# EAGLE design marqee_attiny85 (EAGLE 8.5.2)
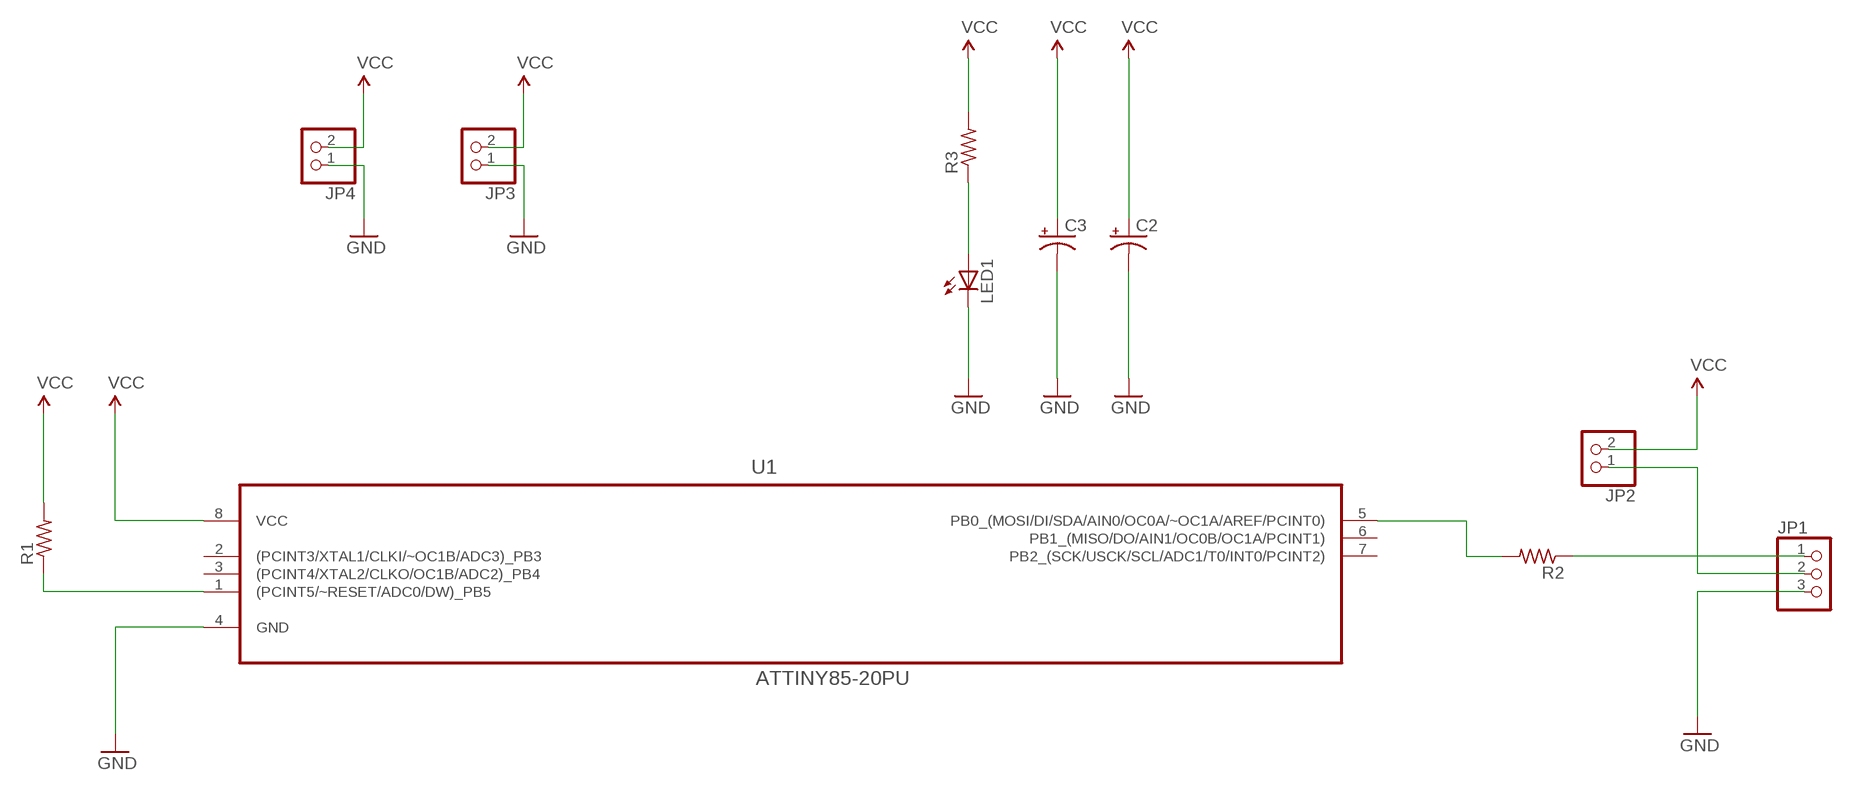
[diagram p0: schematic, sheet 1]

## Parts
C2  CPOL-USE5-8.5  [E5-8,5]
C3  CPOL-USE5-8.5  [E5-8,5]
JP1  PINHD-1X3  [1X03]
JP2  PINHD-1X2  [1X02]
JP3  PINHD-1X2  [1X02]
JP4  PINHD-1X2  [1X02]
LED1  LED5MM  [LED5MM]
R1  R-US_0207/10  [0207/10]
R2  R-US_0207/10  [0207/10]
R3  R-US_0207/10  [0207/10]
U1  ATTINY85-20PU  [DIP254P762X533-8]

## Nets
GND: C2.- C3.- JP1.3 JP3.1 JP4.1 LED1.K(C) U1.4(GND)
N$1: R1.1 U1.1((PCINT5/~RESET/ADC0/DW)_PB5)
N$2: JP1.1 R2.1
N$3: LED1.A R3.1
N$4: R2.2 U1.5(PB0_(MOSI/DI/SDA/AIN0/OC0A/~OC1A/AREF/PCINT0))
N$6: JP1.2 JP2.1
VCC: C2.+ C3.+ JP2.2 JP3.2 JP4.2 R1.2 R3.2 U1.8(VCC)
Unconnected: U1.2((PCINT3/XTAL1/CLKI/~OC1B/ADC3)_PB3) U1.3((PCINT4/XTAL2/CLKO/OC1B/ADC2)_PB4) U1.6(PB1_(MISO/DO/AIN1/OC0B/OC1A/PCINT1)) U1.7(PB2_(SCK/USCK/SCL/ADC1/T0/INT0/PCINT2))

## Library data of the parts
C2 C3 = rcl:CPOL-US: POLARIZED CAPACITOR, American symbol; SPICEPREFIX: C
JP1 = pinhead:PINHD-1X3: PIN HEADER
JP2-JP4 = pinhead:PINHD-1X2: PIN HEADER
LED1 = led:LED: LED OSRAM: - CHIPLED LG R971, LG N971, LY N971, LG Q971, LY Q971, LO R971, LY R971 LH N974, LH R974 LS Q976, LO Q976, LY Q976 LO Q996 - Hyper CHIPLED LW Q18S LB Q993, LB Q99A, LB R99A - SideLED LS A670, LO A670, LY A670, LG A670, LP A670 LB A673, LV A673, LT A673, LW A673 LH A674 LY A675 LS A676, LA A676, LO A676, LY A676, LW A676 LS A679, LY A679, LG A679 - Hyper Micro SIDELED® LS Y876, LA Y876, LO Y876, LY Y876 LT Y87S - SmartLED LW L88C, LW L88S LB L89C, LB L89S, LG L890 LS L89K, LO L89K, LY L89K LS L896, LA L896, LO L896, LY L896 - TOPLED LS T670, LO T670, LY T670, LG T670, LP T670 LSG T670, LSP T670, LSY T670, LOP T670, LYG T670 LG T671, LOG T671, LSG T671 LB T673, LV T673, LT T673, LW T673 LH T674 LS T676, LA T676, LO T676, LY T676, LB T676, LH T676, LSB T676, LW T676 LB T67C, LV T67C, LT T67C, LS T67K, LO T67K, LY T67K, LW E67C LS E67B, LA E67B, LO E67B, LY E67B, LB E67C, LV E67C, LT E67C LW T67C LS T679, LY T679, LG T679 LS T770, LO T770, LY T770, LG T770, LP T770 LB T773, LV T773, LT T773, LW T773 LH T774 LS E675, LA E675, LY E675, LS T675 LS T776, LA T776, LO T776, LY T776, LB T776 LHGB T686 LT T68C, LB T68C - Hyper Mini TOPLED® LB M676 - Mini TOPLED Santana® LG M470 LS M47K, LO M47K, LY M47K Source: http://www.osram.convergy.de LUXEON: - LUMILED® LXK2-PW12-R00, LXK2-PW12-S00, LXK2-PW14-U00, LXK2-PW14-V00 LXK2-PM12-R00, LXK2-PM12-S00, LXK2-PM14-U00 LXK2-PE12-Q00, LXK2-PE12-R00, LXK2-PE12-S00, LXK2-PE14-T00, LXK2-PE14-U00 LXK2-PB12-K00, LXK2-PB12-L00, LXK2-PB12-M00, LXK2-PB14-N00, LXK2-PB14-P00, LXK2-PB14-Q00 LXK2-PR12-L00, LXK2-PR12-M00, LXK2-PR14-Q00, LXK2-PR14-R00 LXK2-PD12-Q00, LXK2-PD12-R00, LXK2-PD12-S00 LXK2-PH12-R00, LXK2-PH12-S00 LXK2-PL12-P00, LXK2-PL12-Q00, LXK2-PL12-R00 Source: www.luxeon.com KINGBRIGHT: KA-3528ASYC Source: www.kingbright.com
R1-R3 = resistor:R-US_: RESISTOR, American symbol
U1 = Atmel_By_element14_Batch_1:ATTINY85-20PU: 8-bit Microcontroller with In-System Programmable Flash; MPN: ATTINY85-20PU; OC_FARNELL: 1455162; OC_NEWARK: 58M3796; PACKAGE: PDIP-8; SUPPLIER: Atmel

## Board
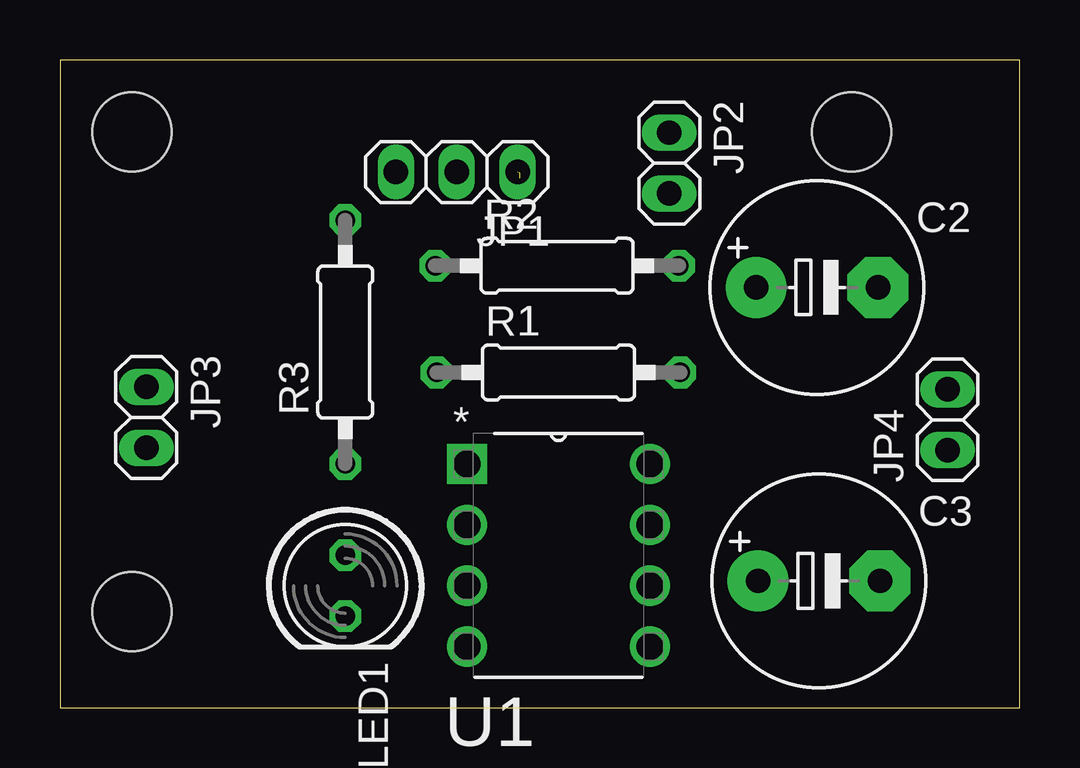
[diagram p1: board, top side]
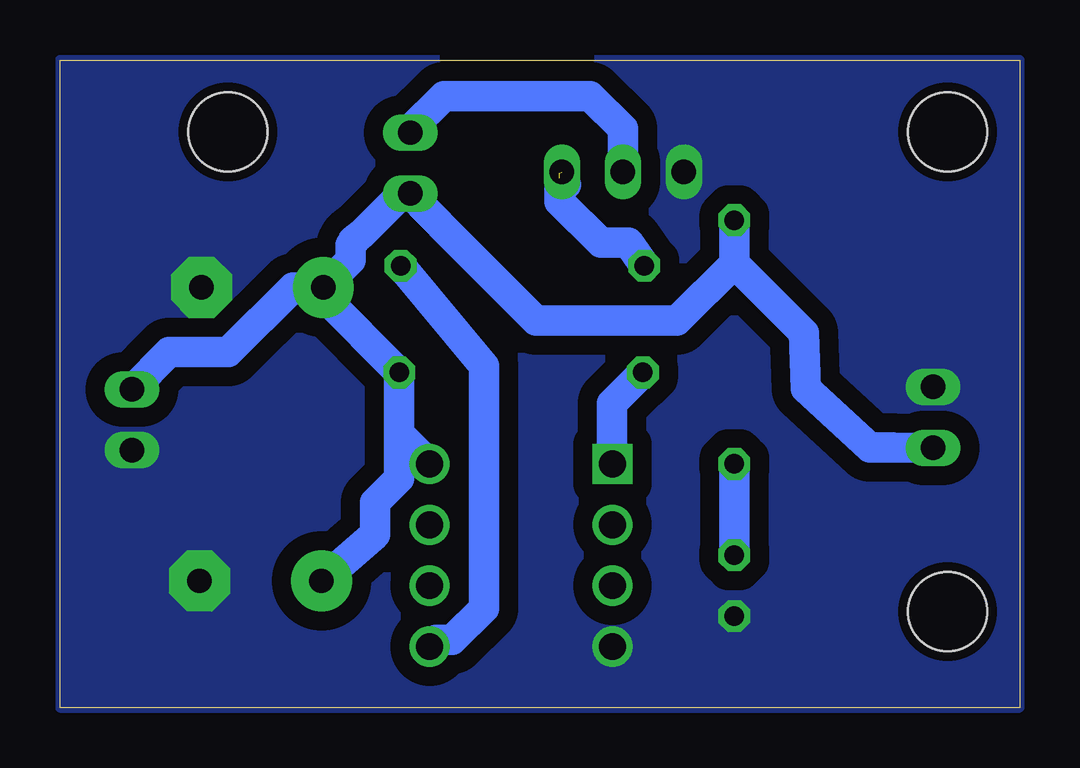
[diagram p2: board, bottom side, seen from below]

Size 40 x 27 mm. Coordinates in mm from the lower left corner, seen from the top.
Outline: 0,0 40,0 40,27 0,27 0,0
Copper layers (1*16): Top 0.035mm / dielectric 1.5mm / Bottom 0.035mm
Design rules "OthermillDRC_1_32_v2": minimum track width 8mil, minimum drill 0.8mm, track to track 0.794003125mm, track to pad 0.794003125mm, pad to pad 0.794003125mm, via to via 0.794003125mm, smd to smd 0mil, copper to edge 0mil, drill to drill 1mil, minimum pad ring 10mil, minimum via ring 10mil, stop-mask expansion 1mil, vias tented up to drill 30mil, thermal gap 10mil
Holes 3.3 mm at 3,24 33,24 3,4

### Footprints (pad centres in the part's own frame; a part is rotated, then mirrored left to right if it is on the bottom)
E5-8,5 = drill 1.016 pad 2.54: + -2.54,0 | drill 1.016 pad 2.54 octagon: - 2.54,0
1X03 = drill 1.016 long: 1 -2.54,0; 2 0,0; 3 2.54,0
1X02 = drill 1.016 long: 1 -1.27,0; 2 1.27,0
LED5MM = drill 0.813 octagon: A -1.27,0; K 1.27,0
0207/10 = drill 0.813 octagon: 1 -5.08,0; 2 5.08,0
DIP254P762X533-8 = drill 1.118 square: 1 -7.62,7.62 | drill 1.118: 2 -7.62,5.08; 3 -7.62,2.54; 4 -7.62,0; 5 0,0; 6 0,2.54; 7 0,5.08; 8 0,7.62

### Placement (x,y rotation side)
C2  31.56,17.52 0 top
C3  31.64,5.28 0 top
JP1  16.54,22.33 180 top
JP2  25.4,22.7 270 top
JP3  3.6,12.1 270 top
JP4  37,12 90 top
LED1  11.89,5.08 270 top
R1  20.78,13.97 0 top
R2  20.72,18.42 0 top
R3  11.89,15.24 90 top
U1  24.59,2.54 0 top

### Tracks (layer width: path | path; a pad name or v marks a point on that pad's centre or on a via)
GND
  pour Bottom (isolate 0.406, no thermals): 0,27 40,27 40,0 0,0
N$1
  Bottom 1.27: R1.1 17,12.67 17,10.13 | 17,10 17,10.13 | 17,10.13 U1.1
N$2  (2 unrouted)
  Bottom 1.27: R2.1 16.3,19.38 17.45,19.38 19.17,21.1 19.17,22.28 | 18.9,21.8 19.17,22.07
N$3
  Bottom 1.27: R3.1 LED1.A
N$4
  Bottom 1.27: U1.5 24.32,2.81 23.65,2.81 22.32,4.14 22.32,14.24 R2.2
N$6
  Bottom 1.27: JP1.2 16.54,24.14 17.9,25.5 24,25.5 25.4,24.1 25.37,23.97 JP2.1
VCC
  Bottom 1.27: U1.8 25.86,11.43 | 25.86,11.43 R1.2 29.02,17.13 C2.+ | JP3.2 5.29,10.84 6.24,10.84 8.9,13.3 9,15.62 11.89,18.51 | 11.89,18.51 14.27,16.13 20.15,16.13 23.73,19.71 JP2.2 25.64,21.53 27.41,19.77 27.78,19.46 27.78,19.39 27.89,19.29 27.89,18.65 C2.+ | C3.+ 26.86,7.22 26.86,8.56 25.86,9.56 25.86,11.43 | JP4.2 35.45,14.82 32.98,14.82 30.28,17.52 C2.+ | 11.89,18.51 R3.2